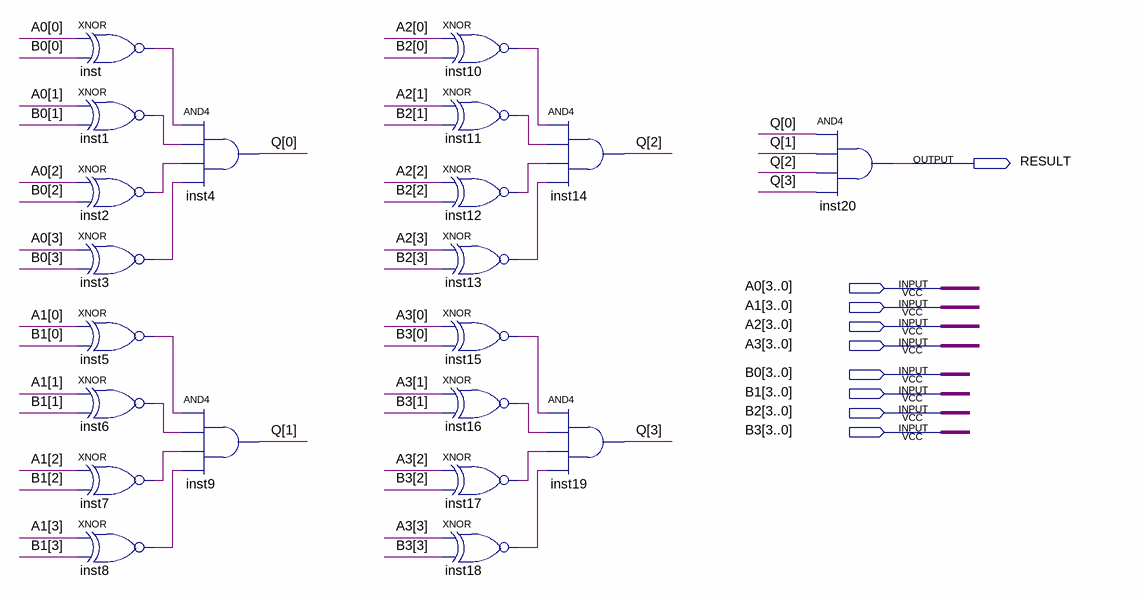
[diagram p0: schematic sheet]
// Quartus schematic comp.bdf as structural Verilog: 21 symbols, 9 pins
module comp (
  input  [3:0] A0,
  input  [3:0] A1,
  input  [3:0] A2,
  input  [3:0] A3,
  input  [3:0] B0,
  input  [3:0] B1,
  input  [3:0] B2,
  input  [3:0] B3,
  output RESULT
);

  wire inst1_out, inst2_out, inst3_out, inst5_out, inst6_out, inst7_out, inst8_out, inst10_out, inst11_out,
       inst12_out, inst13_out, inst15_out, inst16_out, inst17_out, inst18_out, inst_out;
  wire [3:0] Q;

  xnor inst (inst_out, A0[0], B0[0]);
  xnor inst1 (inst1_out, A0[1], B0[1]);
  xnor inst2 (inst2_out, A0[2], B0[2]);
  xnor inst3 (inst3_out, A0[3], B0[3]);
  xnor inst5 (inst5_out, A1[0], B1[0]);
  xnor inst6 (inst6_out, A1[1], B1[1]);
  xnor inst7 (inst7_out, A1[2], B1[2]);
  xnor inst8 (inst8_out, A1[3], B1[3]);
  and inst4 (Q[0], inst_out, inst1_out, inst2_out, inst3_out);
  and inst9 (Q[1], inst5_out, inst6_out, inst7_out, inst8_out);
  xnor inst10 (inst10_out, A2[0], B2[0]);
  xnor inst11 (inst11_out, A2[1], B2[1]);
  xnor inst12 (inst12_out, A2[2], B2[2]);
  xnor inst13 (inst13_out, A2[3], B2[3]);
  xnor inst15 (inst15_out, A3[0], B3[0]);
  xnor inst16 (inst16_out, A3[1], B3[1]);
  xnor inst17 (inst17_out, A3[2], B3[2]);
  xnor inst18 (inst18_out, A3[3], B3[3]);
  and inst14 (Q[2], inst10_out, inst11_out, inst12_out, inst13_out);
  and inst19 (Q[3], inst15_out, inst16_out, inst17_out, inst18_out);
  and inst20 (RESULT, Q[0], Q[1], Q[2], Q[3]);
endmodule
